# EAGLE design TinySparkShield (EAGLE 6.5.0)
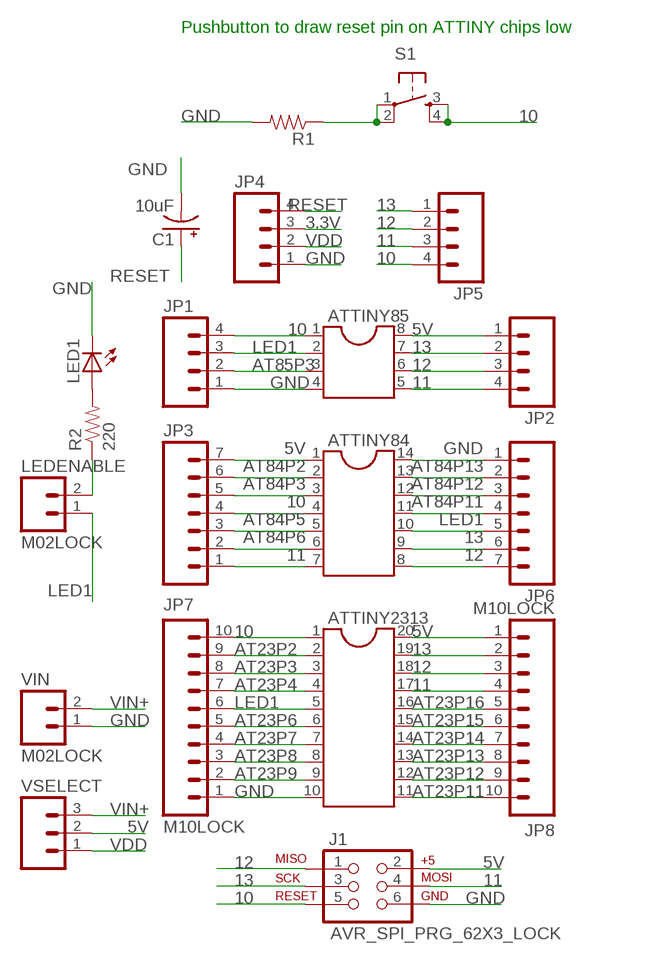
[diagram p0: schematic, sheet 1]

## Parts
ATTINY84  DIL14  [DIL14]
ATTINY85  DIL8  [DIL08]
ATTINY2313  DIL20  [DIL20]
C1  10uF  CAP_POLPTH1  [CPOL-RADIAL-100UF-25V]
J1  AVR_SPI_PRG_62X3_LOCK  [2X3_LOCK]
JP1  M04LOCK  [1X04_LOCK]
JP2  M04LOCK  [1X04_LOCK]
JP3  M07LOCK  [1X07_LOCK]
JP4  M04LOCK  [1X04_LOCK]
JP5  M04LOCK  [1X04_LOCK]
JP6  M07LOCK  [1X07_LOCK]
JP7  M10LOCK  [1X10_LOCK]
JP8  M10LOCK  [1X10_LOCK]
LED1  LED3MM  [LED3MM]
LEDENABLE  M02LOCK  [1X02_LOCK]
R1  RESISTORAXIAL-0.3  [AXIAL-0.3]
R2  220  RESISTORAXIAL-0.3  [AXIAL-0.3]
S1  TAC_SWITCHPTH  [TACTILE-PTH]
VIN  M02LOCK  [1X02_LOCK]
VSELECT  M03LOCK  [1X03_LOCK]

## Nets
3.3V: JP4.3
5V: ATTINY84.1 ATTINY85.8 ATTINY2313.20 J1.2 JP2.1 JP3.7 JP8.1 VSELECT.2
10: ATTINY84.4 ATTINY85.1 ATTINY2313.1 J1.5 JP1.4 JP3.4 JP5.4 JP7.10 S1.3 S1.4
11: ATTINY84.7 ATTINY85.5 ATTINY2313.17 J1.4 JP2.4 JP3.1 JP5.3 JP8.4
12: ATTINY84.8 ATTINY85.6 ATTINY2313.18 J1.1 JP2.3 JP5.2 JP6.7 JP8.3
13: ATTINY84.9 ATTINY85.7 ATTINY2313.19 J1.3 JP2.2 JP5.1 JP6.6 JP8.2
AT23P2: ATTINY2313.2 JP7.9
AT23P3: ATTINY2313.3 JP7.8
AT23P4: ATTINY2313.4 JP7.7
AT23P6: ATTINY2313.6 JP7.5
AT23P7: ATTINY2313.7 JP7.4
AT23P8: ATTINY2313.8 JP7.3
AT23P9: ATTINY2313.9 JP7.2
AT23P11: ATTINY2313.11 JP8.10
AT23P12: ATTINY2313.12 JP8.9
AT23P13: ATTINY2313.13 JP8.8
AT23P14: ATTINY2313.14 JP8.7
AT23P15: ATTINY2313.15 JP8.6
AT23P16: ATTINY2313.16 JP8.5
AT84P2: ATTINY84.2 JP3.6
AT84P3: ATTINY84.3 JP3.5
AT84P5: ATTINY84.5 JP3.3
AT84P6: ATTINY84.6 JP3.2
AT84P11: ATTINY84.11 JP6.4
AT84P12: ATTINY84.12 JP6.3
AT84P13: ATTINY84.13 JP6.2
AT85P3: ATTINY85.3 JP1.2
GND: ATTINY84.14 ATTINY85.4 ATTINY2313.10 C1.2(-) J1.6 JP1.1 JP4.1 JP6.1 JP7.1 LED1.K(C) R1.P$2 VIN.1
LED1: ATTINY84.10 ATTINY85.2 ATTINY2313.5 JP1.3 JP6.5 JP7.6 LEDENABLE.1
N$1: LED1.A R2.P$2
N$2: LEDENABLE.2 R2.P$1
N$3: R1.P$1 S1.1 S1.2
RESET: C1.1(+) JP4.4
VDD: JP4.2 VSELECT.1
VIN+: VIN.2 VSELECT.3

## Notes on the sheet
- Pushbutton to draw reset pin on ATTINY chips low

## Library data of the parts
ATTINY84 = ic-package:DIL14: Dual In Line / Socket
ATTINY85 = ic-package:DIL8: Dual In Line / Socket
ATTINY2313 = ic-package:DIL20: Dual In Line / Socket
C1 = SparkFun-Capacitors:CAP_POL: Capacitor Polarized These are standard SMD and PTH capacitors. Normally 10uF, 47uF, and 100uF in electrolytic and tantalum varieties. Always verify the external diameter of the through hole cap, it varies with capacity, voltage, and manufacturer. The EIA devices should be standard.
J1 = SparkFun-Connectors:AVR_SPI_PRG_6: AVR ISP 6 Pin This is the reduced ISP connector for AVR programming. Common on Arduino. This footprint will take up less PCB space and can be used with a 10-pin to 6-pin adapter such as SKU: BOB-08508
JP1 JP2 JP4 JP5 = SparkFun-Connectors:M04: Header 4 Standard 4-pin 0.1" header. Use with straight break away headers (SKU : PRT-00116), right angle break away headers (PRT-00553), swiss pins (PRT-00743), machine pins (PRT-00117), and female headers (PRT-00115). Molex polarized connector foot print use with SKU : PRT-08231 with associated crimp pins and housings. 1MM SMD Version SKU: PRT-10208
JP3 JP6 = SparkFun-Connectors:M07: Header 7 Standard 7-pin 0.1" header. Use with straight break away headers (SKU : PRT-00116), right angle break away headers (PRT-00553), swiss pins (PRT-00743), machine pins (PRT-00117), and female headers (PRT-00115). NOTES ON THE VARIANTS LOCK and LOCK_LONGPADS... This footprint was designed to help hold the alignment of a through-hole component (i.e. 7-pin header) while soldering it into place. You may notice that each hole has been shifted either up or down by 0.005 of an inch from it's more standard position (which is usually a perfectly straight line). This slight alteration caused the pins (the squares in the middle) to touch the edges of the holes. Because they are alternating, it causes a "brace" to hold the header in place. 0.005 has proven to be the perfect amount of "off-center" position when using our standard breakaway headers. Although looks a little odd when you look at the bare footprint, once you have a header in there, the alteration is very hard to notice. Also, if you push a header all the way into place, it is covered up entirely on the bottom side. This idea of altering the position of holes to aid alignment will be further integrated into the Sparkfun Library for other footprints. It can help hold any component with 3 or more connection pins.
JP7 JP8 = SparkFun-Connectors:M10: Header 10 Standard 10-pin 0.1" header. Use with straight break away headers (SKU : PRT-00116), right angle break away headers (PRT-00553), swiss pins (PRT-00743), machine pins (PRT-00117), and female headers (PRT-00115).
LED1 = led:LED: LED OSRAM: - CHIPLED LG R971, LG N971, LY N971, LG Q971, LY Q971, LO R971, LY R971 LH N974, LH R974 LS Q976, LO Q976, LY Q976 LO Q996 - Hyper CHIPLED LW Q18S LB Q993, LB Q99A, LB R99A - SideLED LS A670, LO A670, LY A670, LG A670, LP A670 LB A673, LV A673, LT A673, LW A673 LH A674 LY A675 LS A676, LA A676, LO A676, LY A676, LW A676 LS A679, LY A679, LG A679 - Hyper Micro SIDELED® LS Y876, LA Y876, LO Y876, LY Y876 LT Y87S - SmartLED LW L88C, LW L88S LB L89C, LB L89S, LG L890 LS L89K, LO L89K, LY L89K LS L896, LA L896, LO L896, LY L896 - TOPLED LS T670, LO T670, LY T670, LG T670, LP T670 LSG T670, LSP T670, LSY T670, LOP T670, LYG T670 LG T671, LOG T671, LSG T671 LB T673, LV T673, LT T673, LW T673 LH T674 LS T676, LA T676, LO T676, LY T676, LB T676, LH T676, LSB T676, LW T676 LB T67C, LV T67C, LT T67C, LS T67K, LO T67K, LY T67K, LW E67C LS E67B, LA E67B, LO E67B, LY E67B, LB E67C, LV E67C, LT E67C LW T67C LS T679, LY T679, LG T679 LS T770, LO T770, LY T770, LG T770, LP T770 LB T773, LV T773, LT T773, LW T773 LH T774 LS E675, LA E675, LY E675, LS T675 LS T776, LA T776, LO T776, LY T776, LB T776 LHGB T686 LT T68C, LB T68C - Hyper Mini TOPLED® LB M676 - Mini TOPLED Santana® LG M470 LS M47K, LO M47K, LY M47K Source: http://www.osram.convergy.de LUXEON: - LUMILED® LXK2-PW12-R00, LXK2-PW12-S00, LXK2-PW14-U00, LXK2-PW14-V00 LXK2-PM12-R00, LXK2-PM12-S00, LXK2-PM14-U00 LXK2-PE12-Q00, LXK2-PE12-R00, LXK2-PE12-S00, LXK2-PE14-T00, LXK2-PE14-U00 LXK2-PB12-K00, LXK2-PB12-L00, LXK2-PB12-M00, LXK2-PB14-N00, LXK2-PB14-P00, LXK2-PB14-Q00 LXK2-PR12-L00, LXK2-PR12-M00, LXK2-PR14-Q00, LXK2-PR14-R00 LXK2-PD12-Q00, LXK2-PD12-R00, LXK2-PD12-S00 LXK2-PH12-R00, LXK2-PH12-S00 LXK2-PL12-P00, LXK2-PL12-Q00, LXK2-PL12-R00 Source: www.luxeon.com KINGBRIGHT: KA-3528ASYC Source: www.kingbright.com
LEDENABLE VIN = SparkFun-Connectors:M02: Standard 2-pin 0.1" header. Use with - straight break away headers ( PRT-00116) - right angle break away headers (PRT-00553) - swiss pins (PRT-00743) - machine pins (PRT-00117) - female headers (PRT-00115) Molex polarized connector foot print use with: PRT-08233 with associated crimp pins and housings. 2.54_SCREWTERM for use with PRT-10571. 3.5mm Screw Terminal footprints for PRT-08084 5mm Screw Terminal footprints for use with PRT-08433
R1 R2 = SparkFun-Passives:RESISTOR: Resistor Basic schematic elements and footprints for 0603, 1206, and PTH resistors.
S1 = SparkFun-Electromechanical:TAC_SWITCH: Momentary Switch Button commonly used for reset or general input. Spark Fun Electronics SKU : COM-00097 SMT- SWCH-08247
VSELECT = SparkFun-Connectors:M03: Header 3 Standard 3-pin 0.1" header. Use with straight break away headers (SKU : PRT-00116), right angle break away headers (PRT-00553), swiss pins (PRT-00743), machine pins (PRT-00117), and female headers (PRT-00115). Molex polarized connector foot print use with SKU : PRT-08232 with associated crimp pins and housings.

## Net classes
0 default: width 0.305 mm, drill 0.508 mm, clearance 0.203 mm

## Board
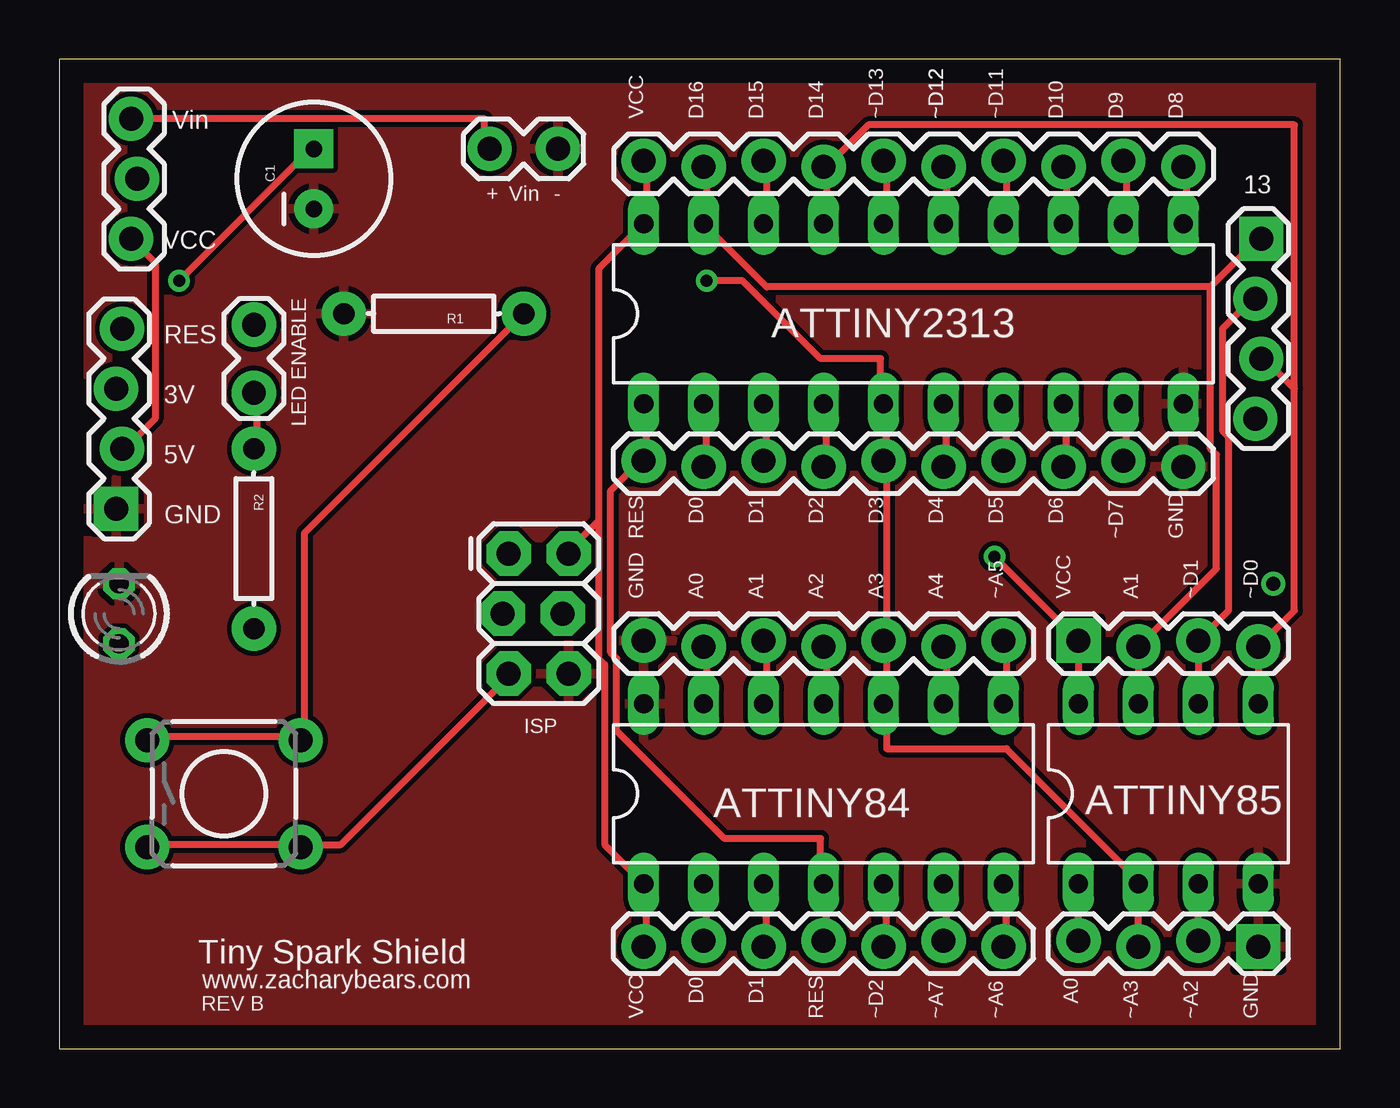
[diagram p1: board, top side]
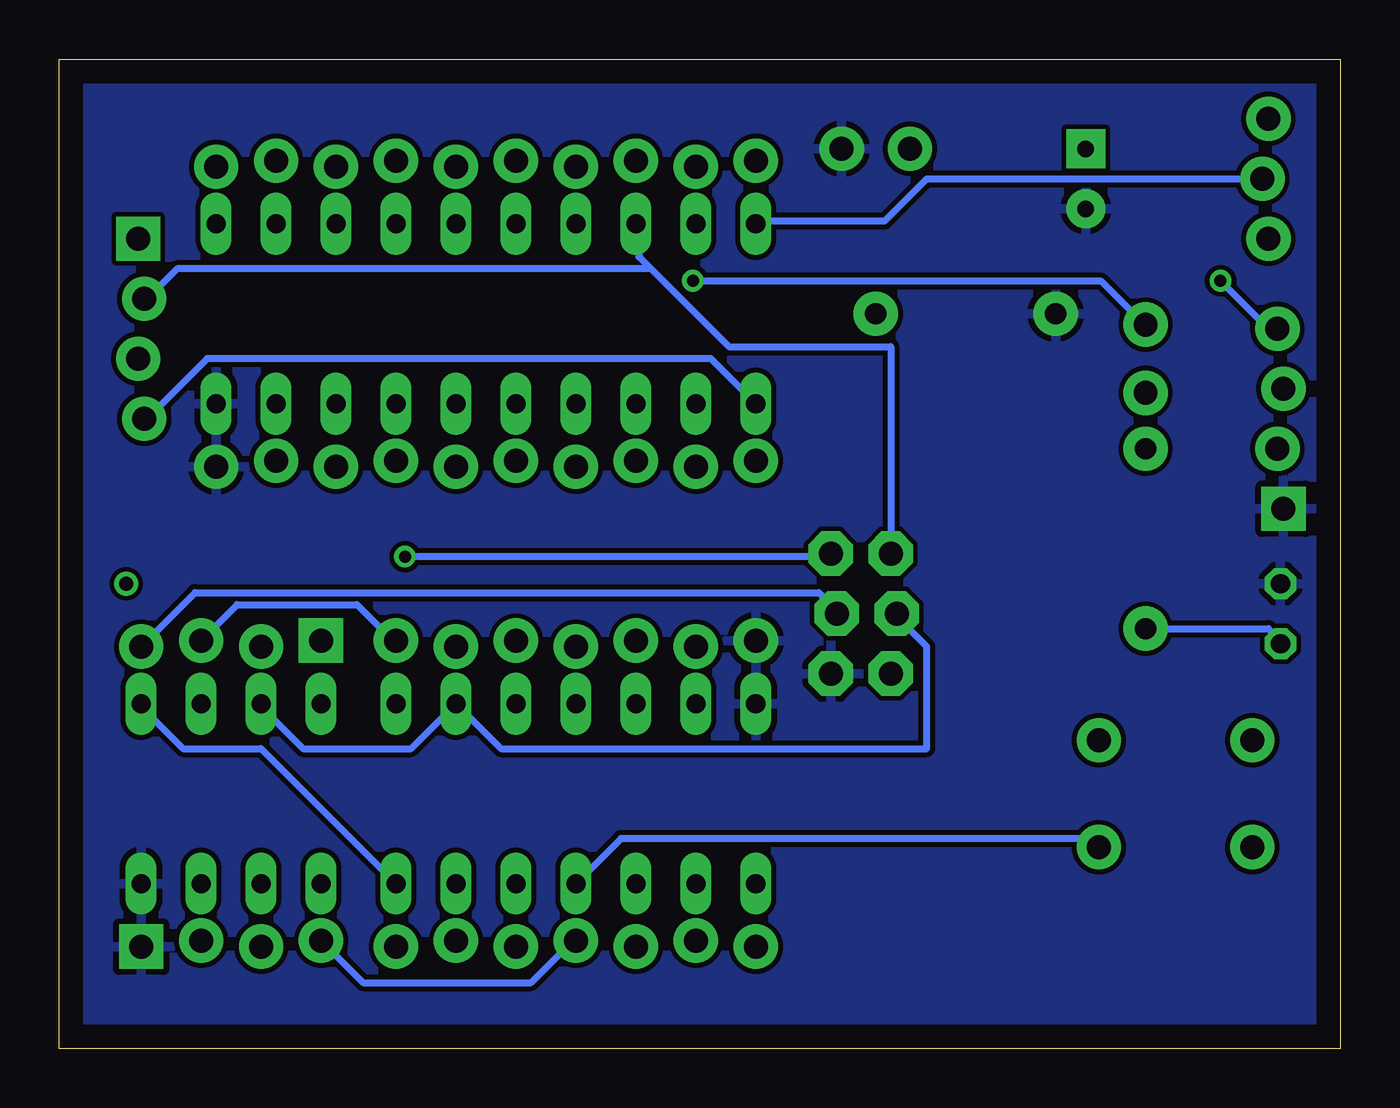
[diagram p2: board, bottom side, seen from below]

Size 54.28 x 41.9 mm. Coordinates in mm from the lower left corner, seen from the top.
Outline: 0,0 54.28,0 54.28,41.9 0,41.9 0,0
Copper layers (1*16): Top 0.035mm / dielectric 1.5mm / Bottom 0.035mm
Design rules "default *": minimum track width 10mil, minimum drill 10mil, track to track 8mil, track to pad 8mil, pad to pad 8mil, via to via 8mil, smd to smd 8mil, copper to edge 40mil, drill to drill 8mil, minimum pad ring 10mil, minimum via ring 8mil, stop-mask expansion 4mil, vias tented up to drill 0mil, thermal gap 10mil

### Footprints (pad centres in the part's own frame; a part is rotated, then mirrored left to right if it is on the bottom)
DIL14 = drill 0.813 long: 1 -7.62,-3.81; 2 -5.08,-3.81; 3 -2.54,-3.81; 4 0,-3.81; 5 2.54,-3.81; 6 5.08,-3.81; 7 7.62,-3.81; 8 7.62,3.81; 9 5.08,3.81; 10 2.54,3.81; 11 0,3.81; 12 -2.54,3.81; 13 -5.08,3.81; 14 -7.62,3.81
DIL08 = drill 0.813 long: 1 -3.81,-3.81; 2 -1.27,-3.81; 3 1.27,-3.81; 4 3.81,-3.81; 5 3.81,3.81; 6 1.27,3.81; 7 -1.27,3.81; 8 -3.81,3.81
DIL20 = drill 0.813 long: 1 -11.43,-3.81; 2 -8.89,-3.81; 3 -6.35,-3.81; 4 -3.81,-3.81; 5 -1.27,-3.81; 6 1.27,-3.81; 7 3.81,-3.81; 8 6.35,-3.81; 9 8.89,-3.81; 10 11.43,-3.81; 11 11.43,3.81; 12 8.89,3.81; 13 6.35,3.81; 14 3.81,3.81; 15 1.27,3.81; 16 -1.27,3.81; 17 -3.81,3.81; 18 -6.35,3.81; 19 -8.89,3.81; 20 -11.43,3.81
CPOL-RADIAL-100UF-25V = drill 0.7 pad 1.651 square: 1 1.27,0 | drill 0.7 pad 1.651: 2 -1.27,0
2X3_LOCK = drill 1.016 pad 1.88 octagon: 1 0,0; 2 0,2.54; 3 2.54,-0.254; 4 2.54,2.286; 5 5.08,0; 6 5.08,2.54
1X04_LOCK = drill 1.016 pad 1.88 square: 1 0,0.127 | drill 1.016 pad 1.88: 2 2.54,-0.127; 3 5.08,0.127; 4 7.62,-0.127
1X07_LOCK = drill 1.016 pad 1.88: 1 0,0.127; 2 2.54,-0.127; 3 5.08,0.127; 4 7.62,-0.127; 5 10.16,0.127; 6 12.7,-0.127; 7 15.24,0.127
1X10_LOCK = drill 1.016 pad 1.88: 1 0,0.127; 2 2.54,-0.127; 3 5.08,0.127; 4 7.62,-0.127; 5 10.16,0.127; 6 12.7,-0.127; 7 15.24,0.127; 8 17.78,-0.127; 9 20.32,0.127; 10 22.86,-0.127
LED3MM = drill 0.813 octagon: A -1.27,0; K 1.27,0
1X02_LOCK = drill 1.016 pad 1.88: 1 -0.178,0; 2 2.718,0
AXIAL-0.3 = drill 0.9 pad 1.88: P$1 -3.81,0; P$2 3.81,0
TACTILE-PTH = drill 1.016 pad 1.88: 1 -3.251,2.261; 2 3.251,2.261; 3 -3.251,-2.261; 4 3.251,-2.261
1X03_LOCK = drill 1.016 pad 1.88: 1 0,0.127; 2 2.54,-0.127; 3 5.08,0.127

### Placement (x,y rotation side)
ATTINY84  32.38,10.79 0 top
ATTINY85  46.99,10.79 0 top
ATTINY2313  36.2,31.11 0 top
C1  10.79,36.83 90 top
J1  19.05,20.95 270 top
JP1  50.8,4.45 180 top
JP2  43.18,17.14 0 top
JP3  40.01,4.45 180 top
JP4  2.54,22.86 90 top
JP5  50.8,34.29 270 top
JP6  24.77,17.14 0 top
JP7  47.62,24.77 180 top
JP8  24.77,37.47 0 top
LED1  2.54,18.41 90 top
LEDENABLE  8.26,30.48 270 top
R1  15.88,31.11 180 top
R2  8.26,21.59 270 top
S1  6.99,10.79 0 top
VIN  20.95,38.1 180 top
VSELECT  3.17,34.29 90 top

### Tracks (layer width: path | path; a pad name or v marks a point on that pad's centre or on a via)
5V  (via drill 0.51)
  Top 0.305: ATTINY85.8 JP2.1 v39.62,20.83 | JP3.7 24.89,4.32 24.89,6.86 ATTINY84.1 23.11,8.64 23.11,16.26 22.86,16.51 22.86,22.35 | JP8.1 24.89,37.59 24.89,35.05 ATTINY2313.20 22.86,33.02 22.86,22.35 | 22.86,22.35 21.59,21.08 J1.2
  Bottom 0.305: VSELECT.2 17.53,36.83 19.3,35.05 24.64,35.05 ATTINY2313.20 | v39.62,20.83 21.59,20.83 J1.2
10
  Top 0.305: ATTINY2313.1 24.89,27.18 24.89,24.89 JP7.10 24.64,24.89 23.37,23.62 23.37,16.76 23.62,16.51 23.62,13.46 28.19,8.89 32.26,8.89 32.26,7.11 ATTINY84.4 32.51,6.86 32.51,4.57 JP3.4 | JP1.4 ATTINY85.1 | S1.3 3.81,8.64 10.16,8.64 S1.4 10.41,8.64 11.94,8.64 19.05,15.75 J1.5
  Bottom 0.305: ATTINY2313.1 26.67,29.21 48.01,29.21 50.55,26.67 JP5.4 | JP1.4 41.4,2.79 34.29,2.79 32.51,4.57 JP3.4 | ATTINY84.4 30.48,8.89 10.67,8.89 10.41,8.64 S1.4
11
  Top 0.305: ATTINY84.7 40.13,6.86 40.13,4.32 JP3.1 | 32.51,37.34 32.51,35.05 ATTINY2313.17 | ATTINY85.5 JP2.4 52.32,18.54 52.32,27.94 | 52.32,27.94 51.05,29.21 JP5.3 | 32.51,37.34 34.29,39.12 52.32,39.12 52.32,27.94 | 32.51,37.34 JP8.4
  Bottom 0.305: JP2.4 48.51,19.3 22.1,19.3 21.34,18.54 J1.4 | ATTINY84.7 45.72,12.7 49.02,12.7 50.8,14.48 ATTINY85.5
12
  Top 0.305: ATTINY84.8 40.13,14.73 40.13,17.27 JP6.7 | ATTINY85.6 JP2.3 49.53,18.54 49.53,25.91 49.28,26.16 49.28,30.48 50.55,31.75 JP5.2 | ATTINY2313.18 29.97,35.05 29.97,37.59 JP8.3
  Bottom 0.305: JP2.3 46.74,18.8 41.66,18.8 40.13,17.27 JP6.7 | J1.1 19.05,29.72 25.91,29.72 29.21,33.02 | 29.21,33.02 29.72,33.53 29.72,34.8 ATTINY2313.18 | 29.21,33.02 49.28,33.02 50.55,31.75 JP5.2
13
  Top 0.305: ATTINY84.9 37.59,14.73 37.59,17.02 JP6.6 | JP8.2 27.43,37.34 27.43,35.05 ATTINY2313.19 29.97,32.26 48.77,32.26 | ATTINY85.7 JP2.2 49.02,20.32 49.02,25.15 48.77,25.4 48.77,32.26 | 48.77,32.26 50.8,34.29 JP5.1
  Bottom 0.305: J1.3 18.8,18.29 17.53,17.02 17.53,12.7 35.56,12.7 ATTINY84.9 39.37,12.7 43.94,12.7 45.72,14.48 ATTINY85.7
AT23P2
  Top 0.305: ATTINY2313.2 27.43,27.18 27.43,24.64 JP7.9
AT23P3
  Top 0.305: ATTINY2313.3 29.97,27.18 29.97,24.89 JP7.8
AT23P4
  Top 0.305: ATTINY2313.4 32.51,27.18 32.51,24.64 JP7.7
AT23P6
  Top 0.305: ATTINY2313.6 37.59,27.18 37.59,24.64 JP7.5
AT23P7
  Top 0.305: ATTINY2313.7 40.13,27.18 40.13,24.89 JP7.4
AT23P8
  Top 0.305: ATTINY2313.8 42.67,27.18 42.67,24.64 JP7.3
AT23P9
  Top 0.305: ATTINY2313.9 45.21,27.18 45.21,24.89 JP7.2
AT23P11
  Top 0.305: ATTINY2313.11 47.75,35.05 47.75,37.34 JP8.10
AT23P12
  Top 0.305: ATTINY2313.12 45.21,35.05 45.21,37.59 JP8.9
AT23P13
  Top 0.305: ATTINY2313.13 42.67,35.05 42.67,37.34 JP8.8
AT23P14
  Top 0.305: ATTINY2313.14 40.13,35.05 40.13,37.59 JP8.7
AT23P15
  Top 0.305: ATTINY2313.15 37.59,35.05 37.59,37.34 JP8.6
AT23P16
  Top 0.305: ATTINY2313.16 35.05,35.05 35.05,37.59 JP8.5
AT84P2
  Top 0.305: ATTINY84.2 27.43,6.86 27.43,4.57 JP3.6
AT84P3
  Top 0.305: ATTINY84.3 29.97,6.86 29.97,4.32 JP3.5
AT84P5
  Top 0.305: ATTINY84.5 35.05,6.86 35.05,4.32 JP3.3
AT84P6
  Top 0.305: ATTINY84.6 37.59,6.86 37.59,4.57 JP3.2
AT84P11
  Top 0.305: ATTINY84.11 32.51,14.73 32.51,17.02 JP6.4
AT84P12
  Top 0.305: ATTINY84.12 29.97,14.73 29.97,17.27 JP6.3
AT84P13
  Top 0.305: ATTINY84.13 27.43,14.73 27.43,17.02 JP6.2
AT85P3
  Top 0.305: JP1.2 ATTINY85.3
GND
  pour Top: -7.62,57.15 61.59,57.15 61.59,-3.81 -7.62,-3.81
  pour Bottom: -8.89,59.69 64.14,59.69 64.14,-7.62 -8.89,-7.62
LED1  (via drill 0.51)
  Top 0.305: JP1.3 ATTINY85.2 45.72,7.11 40.13,12.7 35.05,12.7 35.05,14.48 ATTINY84.10 35.05,14.73 35.05,17.27 | 35.05,24.89 35.05,27.18 ATTINY2313.5 34.8,27.43 34.8,29.21 32.26,29.21 28.96,32.51 v27.43,32.51 | 35.05,24.89 35.05,17.27 | 35.05,17.27 JP6.5 | 35.05,24.89 JP7.6
  Bottom 0.305: v27.43,32.51 10.16,32.51 8.38,30.73 LEDENABLE.1
N$1
  Bottom 0.305: R2.P$2 3.05,17.78 2.54,17.27 LED1.A
N$2
  Top 0.305: R2.P$1 8.38,25.4 8.38,27.69 LEDENABLE.2
N$3
  Top 0.305: S1.1 3.81,13.21 10.16,13.21 S1.2 10.41,13.21 10.41,21.84 R1.P$1
N$23  (via drill 0.6)
  other vias: 51.44,19.68
RESET  (via drill 0.51)
  Top 0.305: v5.08,32.51 10.67,38.1 C1.1
  Bottom 0.305: v5.08,32.51 3.05,30.48 JP4.4
VDD
  Top 0.305: VSELECT.1 4.06,33.27 4.06,26.67 2.79,25.4 JP4.2
VIN+
  Top 0.305: VSELECT.3 18.03,39.37 18.03,38.1 VIN.2

### Text on the board
tPlace: C:/Users/Zachary/Desktop/Blog/Images/Logo/LogoV1_0.bmp | C:/Users/Zachary/Desktop/Blog/Images/Logo/LogoV1_0_PCB.bmp
tNames: Vin | VCC | D16 | D15 | D14 | ~D13 | ~D12 | ~D12 | ~D11 | D10 | D9 | D8 | + | Vin | - | 13 | VCC | RES | 3V | LED ENABLE | 5V | GND | RES | D0 | D1 | D2 | D3 | D4 | D5 | D6 | ~D7 | GND | GND | A0 | A1 | A2 | A3 | A4 | ~A5 | VCC | A1 | ~D1 | ~D0 | ISP | Tiny Spark Shield | www.zacharybears.com | REV B | D0 | D1 | A0 | VCC | RES | ~D2 | ~A7 | ~A6 | ~A3 | ~A2 | GND